# EAGLE design 85programmer (EAGLE 6.5.0)
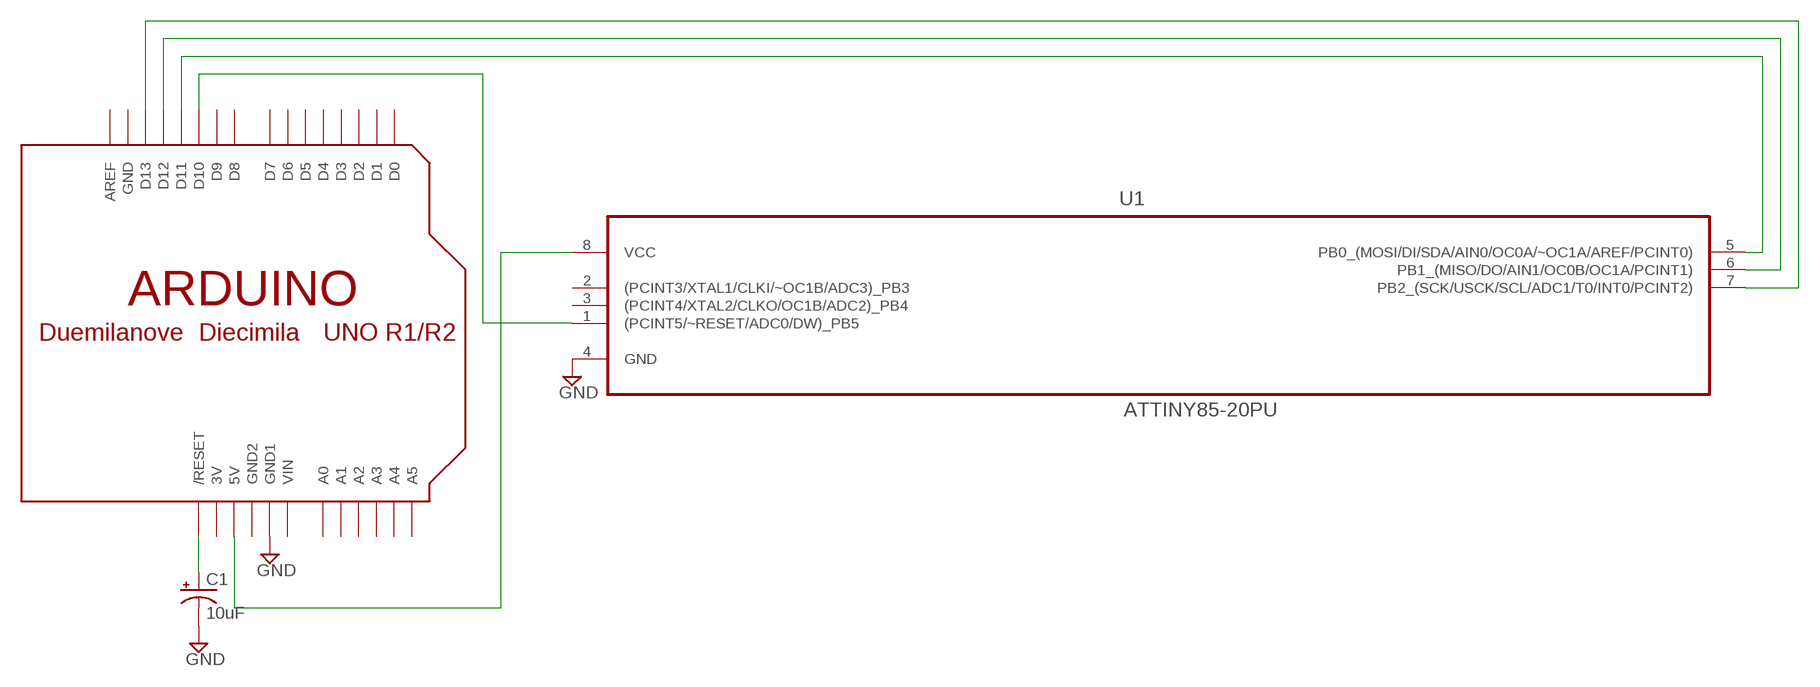
[diagram p0: schematic, sheet 1]

## Parts
C1  10uF  CPOL-USE2,5-6E  [E2,5-6E]
U1  ATTINY85-20PU  [DIP254P762X533-8]
U$1  ARDUINOUNO  [ARDUINO]

## Nets
GND: C1.- U1.4(GND) U$1.GND1
N$1: C1.+ U$1.RESET(/RESET)
N$2: U1.8(VCC) U$1.5V
N$3: U1.5(PB0_(MOSI/DI/SDA/AIN0/OC0A/~OC1A/AREF/PCINT0)) U$1.D11
N$4: U1.6(PB1_(MISO/DO/AIN1/OC0B/OC1A/PCINT1)) U$1.D12
N$5: U1.7(PB2_(SCK/USCK/SCL/ADC1/T0/INT0/PCINT2)) U$1.D13
N$6: U1.1((PCINT5/~RESET/ADC0/DW)_PB5) U$1.D10
Unconnected: U1.2((PCINT3/XTAL1/CLKI/~OC1B/ADC3)_PB3) U1.3((PCINT4/XTAL2/CLKO/OC1B/ADC2)_PB4) U$1.A0 U$1.A1 U$1.A2 U$1.A3 U$1.A4 U$1.A5 U$1.AREF U$1.D0 U$1.D1 U$1.D2 U$1.D3 U$1.D4 U$1.D5 U$1.D6 U$1.D7 U$1.D8 U$1.D9

## Power pins joined to a net without a drawn wire
3V: U$1.3V
GND: U$1.GND
GND2: U$1.GND2
VIN: U$1.VIN

## Library data of the parts
C1 = rcl:CPOL-US: POLARIZED CAPACITOR, American symbol
U1 = Atmel_By_element14_Batch_1-00:ATTINY85-20PU: 8-bit Microcontroller with In-System Programmable Flash; MPN: ATTINY85-20PU; OC_FARNELL: 1455162; OC_NEWARK: 58M3796; PACKAGE: PDIP-8; SUPPLIER: Atmel
U$1 = adafruit:ARDUINO: Arduino Diecimila/Duemilanove Make a shield with ease, this package has all the named pins as well as the two mounting drill holes and an outline of the USB and DC power connector. The outline is on the DIMENSION layer, so if your board house uses it they will cut the outline to match. http://www.ladyada.net/library/pcb/eaglelibrary.html

## Net classes
0 default: width 0.508 mm, drill 0.508 mm, clearance 0.508 mm

## Board
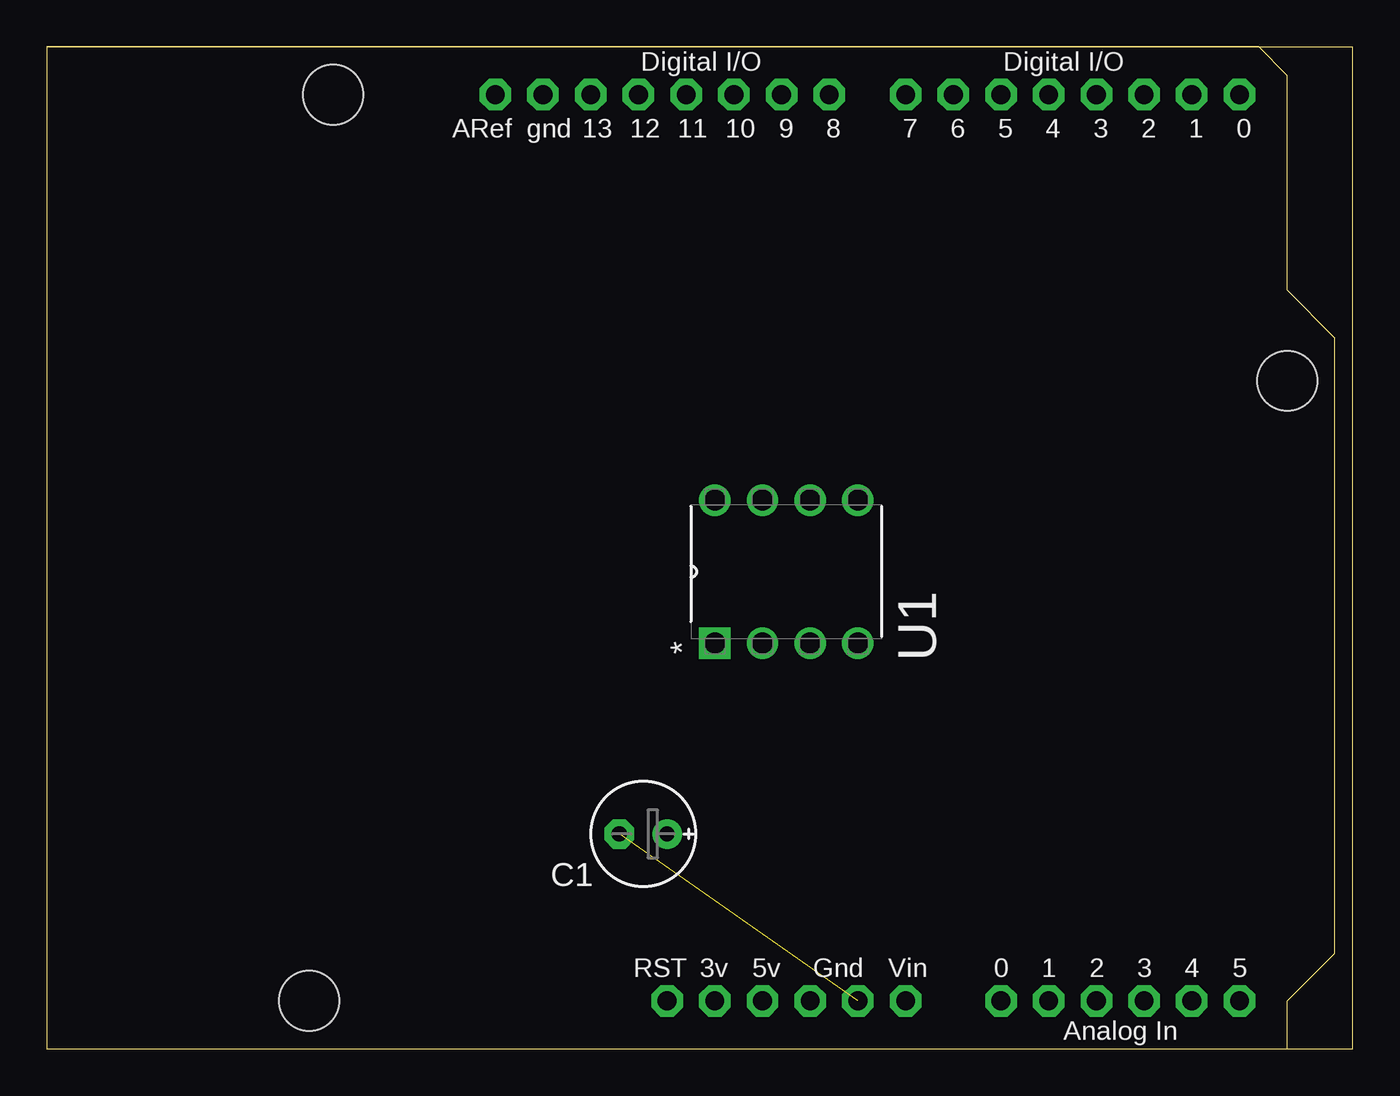
[diagram p1: board, top side]
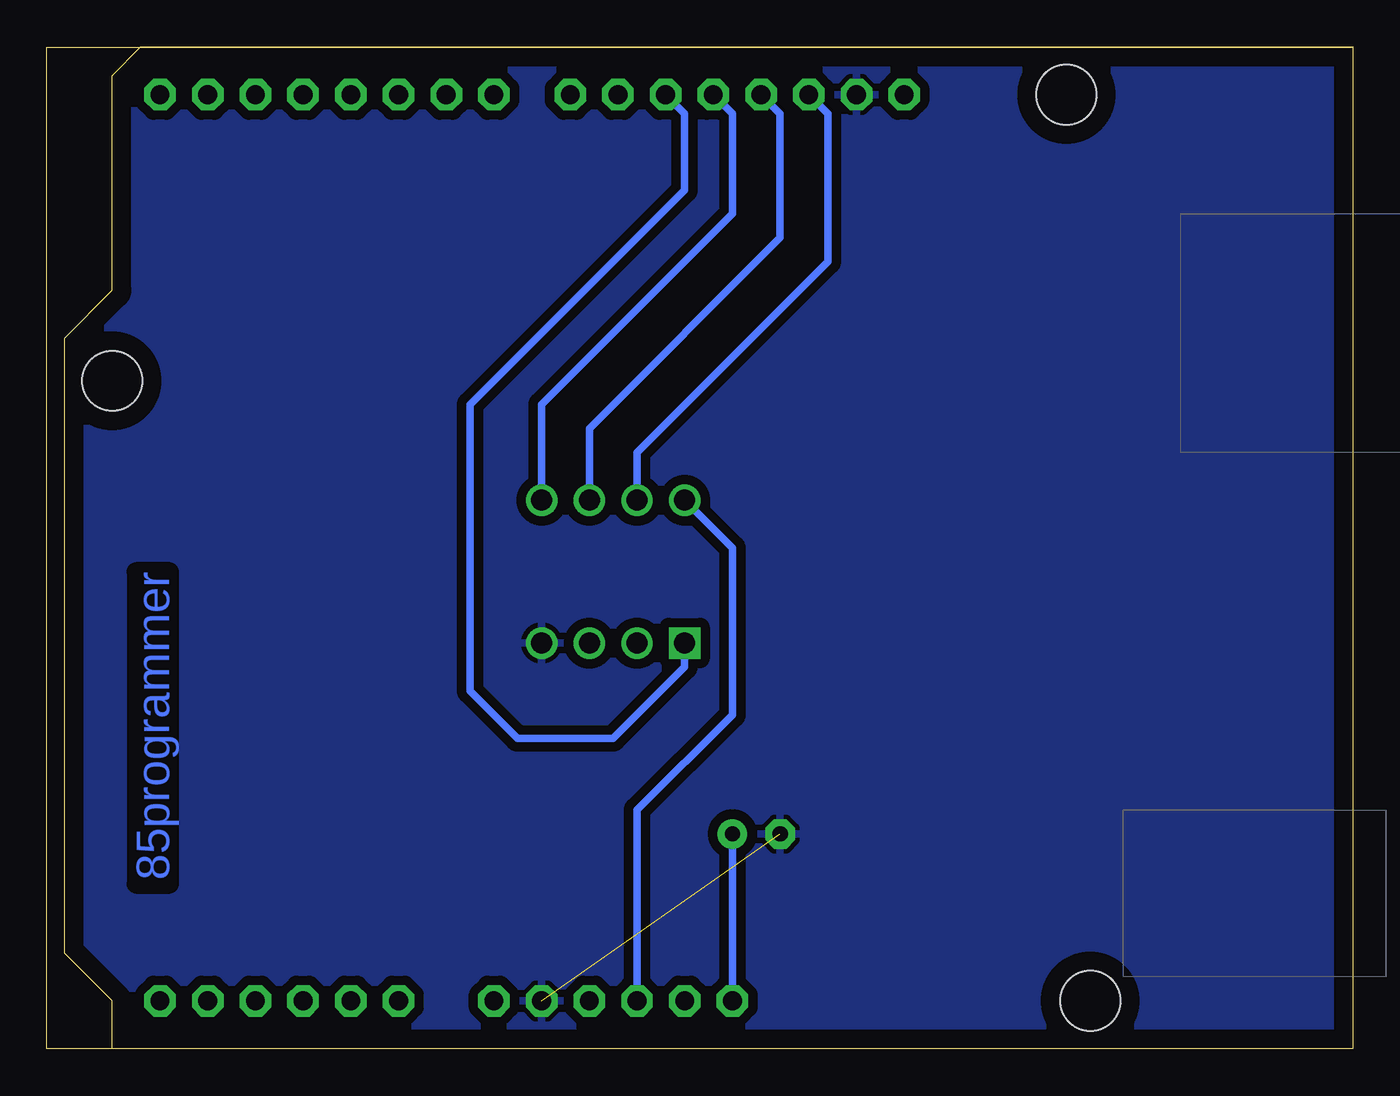
[diagram p2: board, bottom side, seen from below]

Size 69.52 x 53.34 mm. Coordinates in mm from the lower left corner, seen from the top.
Outline: 0,0 69.52,0 69.52,53.33 0,53.33 0,0
Copper layers (1*16): Top 0.035mm / dielectric 1.5mm / Bottom 0.035mm
Design rules "default": minimum track width 10mil, minimum drill 24mil, track to track 8mil, track to pad 8mil, pad to pad 8mil, via to via 8mil, smd to smd 8mil, copper to edge 40mil, drill to drill 8mil, minimum pad ring 10mil, minimum via ring 8mil, stop-mask expansion 4mil, vias tented up to drill 0mil, thermal gap 10mil

### Footprints (pad centres in the part's own frame; a part is rotated, then mirrored left to right if it is on the bottom)
E2,5-6E = drill 0.813 pad 1.575: + -1.27,0 | drill 0.813 pad 1.575 octagon: - 1.27,0
DIP254P762X533-8 = drill 1.118 square: 1 -7.62,7.62 | drill 1.118: 2 -7.62,5.08; 3 -7.62,2.54; 4 -7.62,0; 5 0,0; 6 0,2.54; 7 0,5.08; 8 0,7.62
ARDUINO = drill 1 pad 1.676 octagon: 3V 35.56,2.54; 5V 38.1,2.54; A0 50.8,2.54; A1 53.34,2.54; A2 55.88,2.54; A3 58.42,2.54; A4 60.96,2.54; A5 63.5,2.54; AREF 23.876,50.8; D0 63.5,50.8; D1 60.96,50.8; D2 58.42,50.8; D3 55.88,50.8; D4 53.34,50.8; D5 50.8,50.8; D6 48.26,50.8; D7 45.72,50.8; D8 41.656,50.8; D9 39.116,50.8; D10 36.576,50.8; D11 34.036,50.8; D12 31.496,50.8; D13 28.956,50.8; GND 26.416,50.8; GND1 43.18,2.54; GND2 40.64,2.54; RESET 33.02,2.54; VIN 45.72,2.54 | hole 3.2: 15.24,50.8; 66.04,35.56; 13.97,2.54

### Placement (x,y rotation side)
C1  31.75,11.43 180 top
U1  43.18,29.21 90 top
U$1  0,0 0 top

### Tracks (layer width: path | path; a pad name or v marks a point on that pad's centre or on a via)
GND  (1 unrouted)
  pour Bottom: -3.81,55.88 72.39,55.88 72.39,-3.81 -3.81,-3.81
N$1
  Bottom 0.406: U$1.RESET C1.+
N$2
  Bottom 0.406: U$1.5V 38.1,12.7 33.02,17.78 33.02,26.67 U1.8
N$3
  Bottom 0.406: U1.5 43.18,34.29 33.02,44.45 33.02,49.78 U$1.D11
N$4
  Bottom 0.406: U1.6 40.64,33.02 30.48,43.18 30.48,49.78 U$1.D12
N$5
  Bottom 0.406: U1.7 38.1,31.75 27.94,41.91 27.94,49.78 U$1.D13
N$6
  Bottom 0.406: U1.1 35.56,20.32 39.37,16.51 44.45,16.51 46.99,19.05 46.99,34.29 35.56,45.72 35.56,49.78 U$1.D10

### Text on the board
Bottom: 85programmer